# EAGLE design xe-sas (EAGLE 9.4.2)
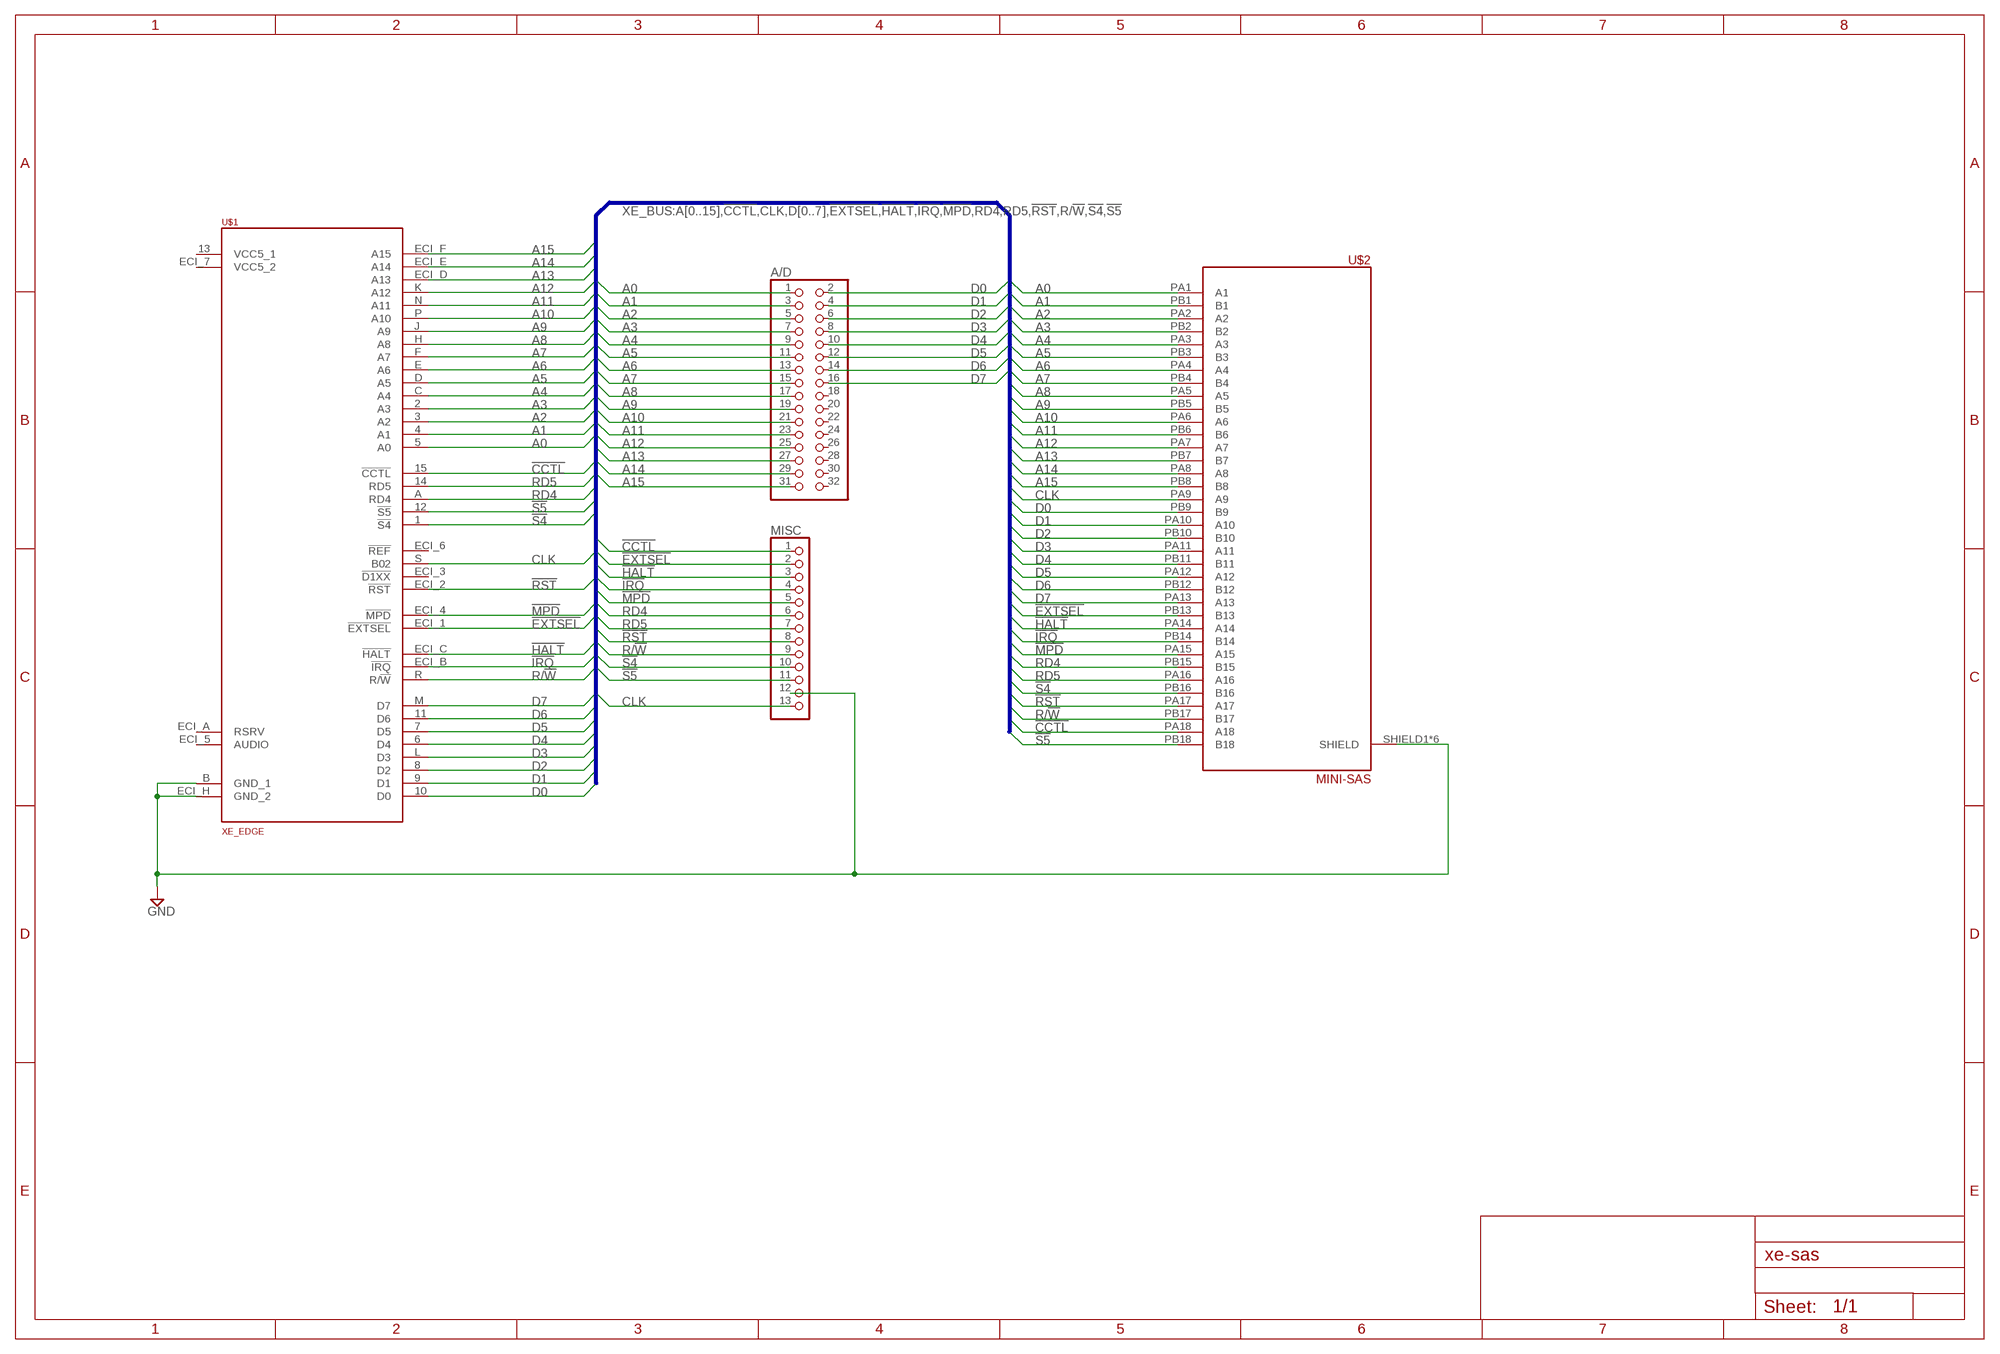
[diagram p0: schematic, sheet 1]

## Parts
A/D  PINHD-2X16  [2X16]
MISC  PINHD-1X13  [1X13]
U$1  XE_EDGE  [XE_EDGE]
U$2  MINI-SAS  [MINI-SAS]

## Nets
!CCTL!: MISC.1 U$1.15(!CCTL!) U$2.PA18(A18)
!EXTSEL!: MISC.2 U$1.ECI_1(!EXTSEL!) U$2.PB13(B13)
!HALT!: MISC.3 U$1.ECI_C(!HALT!) U$2.PA14(A14)
!IRQ!: MISC.4 U$1.ECI_B(!IRQ!) U$2.PB14(B14)
!MPD!: MISC.5 U$1.ECI_4(!MPD!) U$2.PA15(A15)
!RST!: MISC.8 U$1.ECI_2(!RST!) U$2.PA17(A17)
!S4!: MISC.10 U$1.1(!S4!) U$2.PB16(B16)
!S5!: MISC.11 U$1.12(!S5!) U$2.PB18(B18)
A0: A/D.1 U$1.5(A0) U$2.PA1(A1)
A1: A/D.3 U$1.4(A1) U$2.PB1(B1)
A2: A/D.5 U$1.3(A2) U$2.PA2(A2)
A3: A/D.7 U$1.2(A3) U$2.PB2(B2)
A4: A/D.9 U$1.C(A4) U$2.PA3(A3)
A5: A/D.11 U$1.D(A5) U$2.PB3(B3)
A6: A/D.13 U$1.E(A6) U$2.PA4(A4)
A7: A/D.15 U$1.F(A7) U$2.PB4(B4)
A8: A/D.17 U$1.H(A8) U$2.PA5(A5)
A9: A/D.19 U$1.J(A9) U$2.PB5(B5)
A10: A/D.21 U$1.P(A10) U$2.PA6(A6)
A11: A/D.23 U$1.N(A11) U$2.PB6(B6)
A12: A/D.25 U$1.K(A12) U$2.PA7(A7)
A13: A/D.27 U$1.ECI_D(A13) U$2.PB7(B7)
A14: A/D.29 U$1.ECI_E(A14) U$2.PA8(A8)
A15: A/D.31 U$1.ECI_F(A15) U$2.PB8(B8)
CLK: MISC.13 U$1.S(B02) U$2.PA9(A9)
D0: A/D.2 U$1.10(D0) U$2.PB9(B9)
D1: A/D.4 U$1.9(D1) U$2.PA10(A10)
D2: A/D.6 U$1.8(D2) U$2.PB10(B10)
D3: A/D.8 U$1.L(D3) U$2.PA11(A11)
D4: A/D.10 U$1.6(D4) U$2.PB11(B11)
D5: A/D.12 U$1.7(D5) U$2.PA12(A12)
D6: A/D.14 U$1.11(D6) U$2.PB12(B12)
D7: A/D.16 U$1.M(D7) U$2.PA13(A13)
GND: MISC.12 U$1.B(GND_1) U$1.ECI_H(GND_2) U$2.SHIELD1(SHIELD) U$2.SHIELD2(SHIELD) U$2.SHIELD3(SHIELD) U$2.SHIELD4(SHIELD) U$2.SHIELD5(SHIELD) U$2.SHIELD6(SHIELD)
R/!W!: MISC.9 U$1.R(R/!W!) U$2.PB17(B17)
RD4: MISC.6 U$1.A(RD4) U$2.PB15(B15)
RD5: MISC.7 U$1.14(RD5) U$2.PA16(A16)
Unconnected: A/D.18 A/D.20 A/D.22 A/D.24 A/D.26 A/D.28 A/D.30 A/D.32 U$1.13(VCC5_1) U$1.ECI_3(!D1XX!) U$1.ECI_5(AUDIO) U$1.ECI_6(!REF!) U$1.ECI_7(VCC5_2) U$1.ECI_A(RSRV)

## Buses
XE_BUS:A[0..15],!CCTL!,CLK,D[0..7],!EXTSEL!,!HALT!,!IRQ!,!MPD!,RD4,RD5,!RST!,R/!W!,!S4!,!S5!

## Library data of the parts
A/D = pinhead:PINHD-2X16: PIN HEADER
MISC = pinhead:PINHD-1X13: PIN HEADER
U$1 = pbxl:XE_EDGE: Atari XE Cartridge/ECI edge connector
U$2 = sjg-con:MINI-SAS: Mini-SAS connector, right angle through hole Part 1888019-4 Digikey part A111092CT-ND

## Net classes
1 Power: width 0.305 mm, drill 0.203 mm, clearance 0.203 mm

## Board
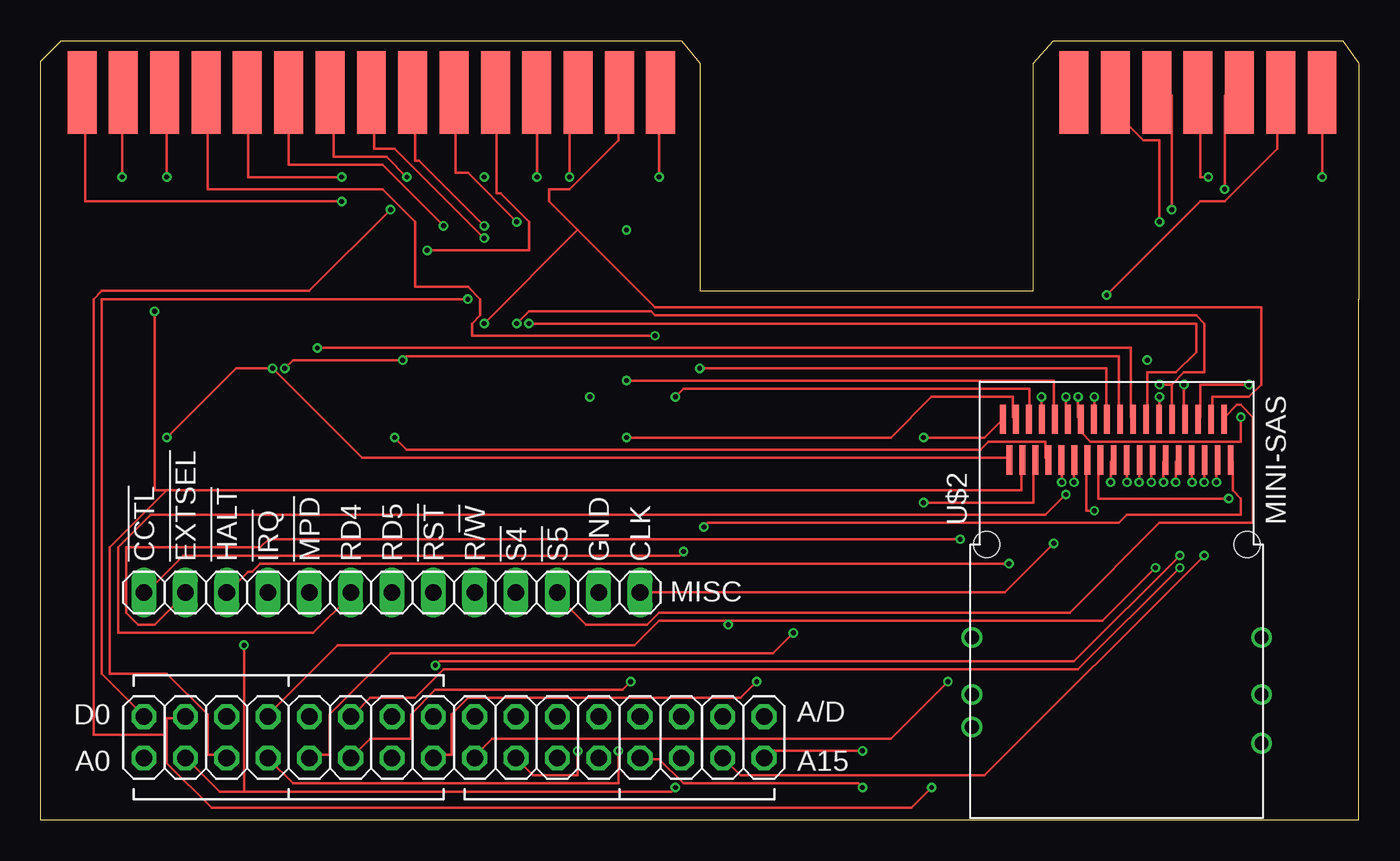
[diagram p1: board, top side]
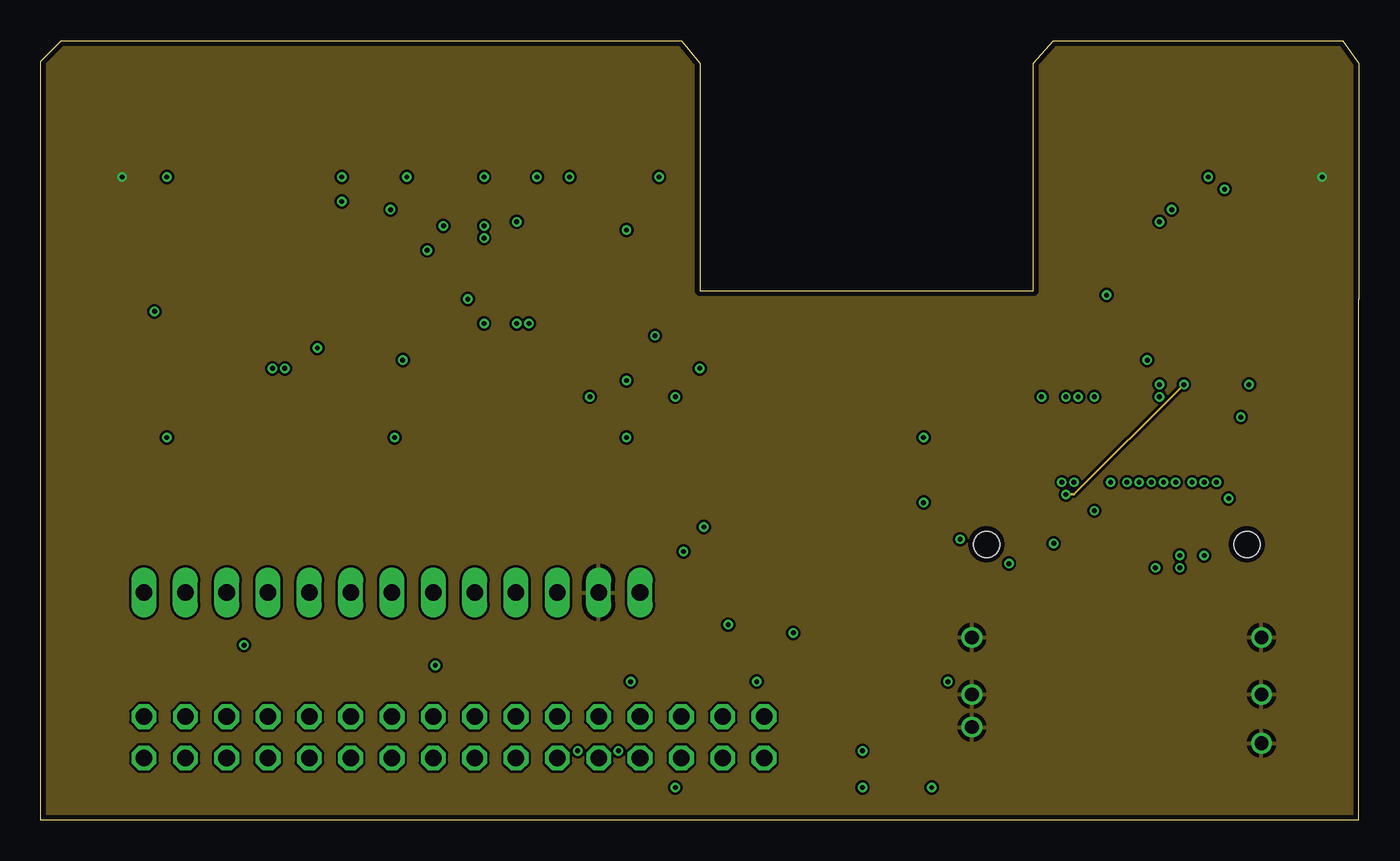
[diagram p2: board, inner layer Route2]
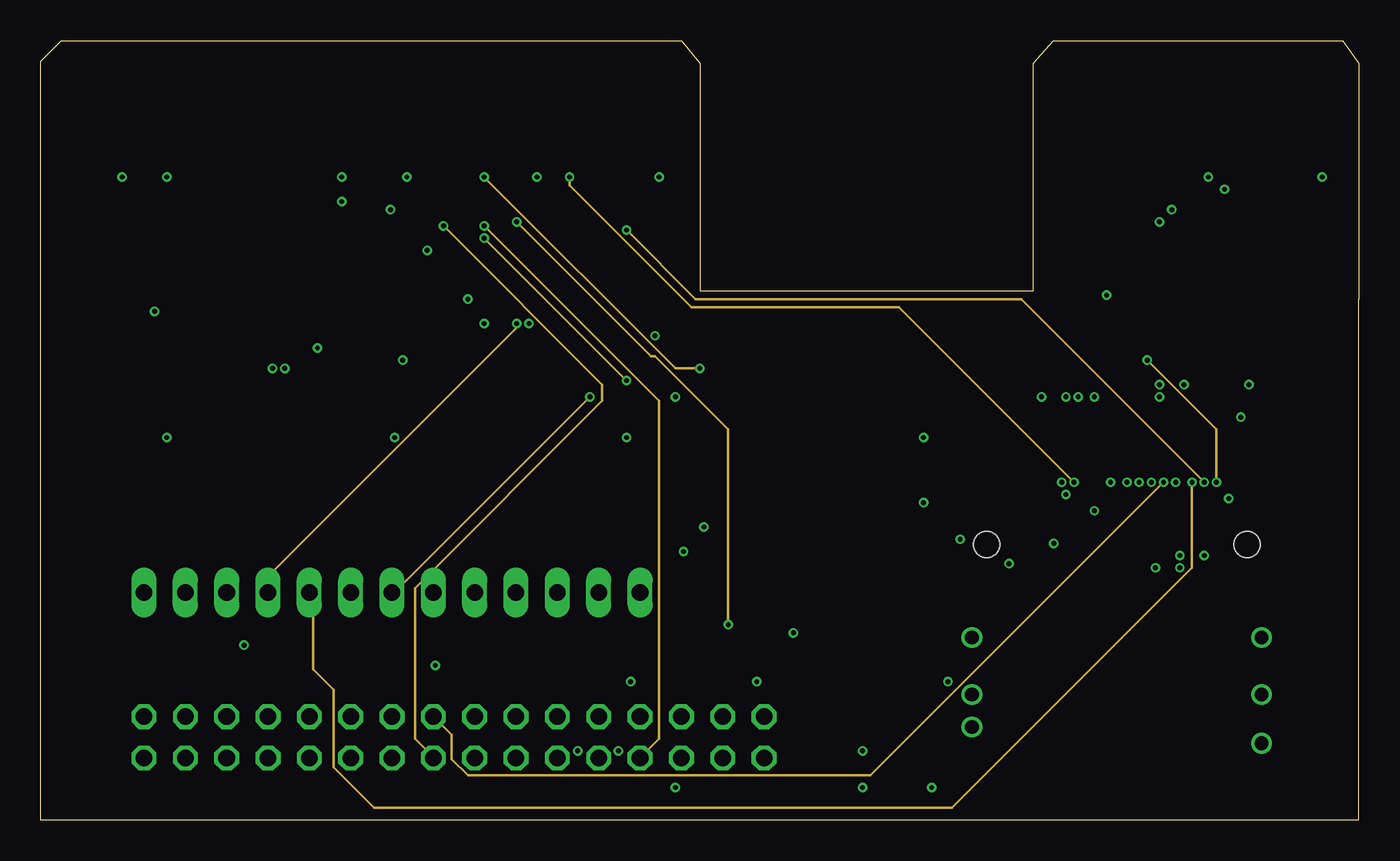
[diagram p3: board, inner layer Route15]
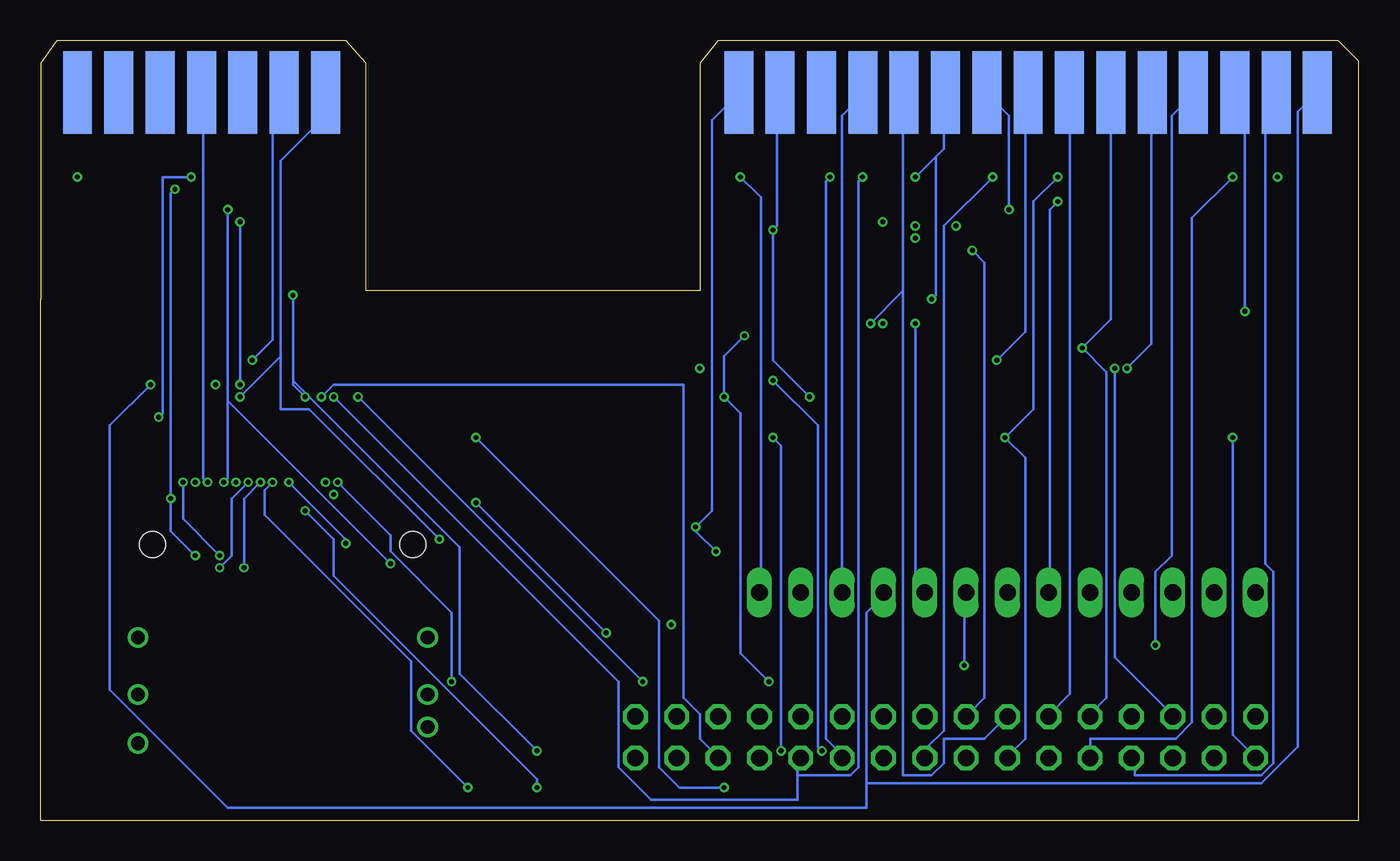
[diagram p4: board, bottom side, seen from below]

Size 81 x 47.88 mm. Coordinates in mm from the lower left corner, seen from the top.
Outline: 81,32 81,0 0,0 0,32
Copper layers (1+2*15+16): Top 0.035mm / dielectric 0.2mm / Route2 0.017mm / dielectric 1.2mm / Route15 0.017mm / dielectric 0.2mm / Bottom 0.035mm
Design rules "seed-4layer-6.6": minimum track width 6mil, minimum drill 0.3mm, track to track 6mil, track to pad 6mil, pad to pad 6mil, via to via 6mil, smd to smd 0mil, copper to edge 12mil, drill to drill 12mil, minimum pad ring 6mil, minimum via ring 5.5mil, stop-mask expansion 4mil, vias tented up to drill 25mil, thermal gap 10mil
vRestrict: area 5,15 to 39,23; area 1,2 to 5,9; area 46,2 to 50,8; area 0,40 to 82,48; area 57,0 to 75,15

### Footprints (pad centres in the part's own frame; a part is rotated, then mirrored left to right if it is on the bottom)
2X16 = drill 1.016 octagon: 1 -19.05,-1.27; 2 -19.05,1.27; 3 -16.51,-1.27; 4 -16.51,1.27; 5 -13.97,-1.27; 6 -13.97,1.27; 7 -11.43,-1.27; 8 -11.43,1.27; 9 -8.89,-1.27; 10 -8.89,1.27; 11 -6.35,-1.27; 12 -6.35,1.27; 13 -3.81,-1.27; 14 -3.81,1.27; 15 -1.27,-1.27; 16 -1.27,1.27; 17 1.27,-1.27; 18 1.27,1.27; 19 3.81,-1.27; 20 3.81,1.27; 21 6.35,-1.27; 22 6.35,1.27; 23 8.89,-1.27; 24 8.89,1.27; 25 11.43,-1.27; 26 11.43,1.27; 27 13.97,-1.27; 28 13.97,1.27; 29 16.51,-1.27; 30 16.51,1.27; 31 19.05,-1.27; 32 19.05,1.27
1X13 = drill 1.016 long: 1 -15.24,0; 2 -12.7,0; 3 -10.16,0; 4 -7.62,0; 5 -5.08,0; 6 -2.54,0; 7 0,0; 8 2.54,0; 9 5.08,0; 10 7.62,0; 11 10.16,0; 12 12.7,0; 13 15.24,0
XE_EDGE = smd 1.778 x 5.08 bottom: 1 2.54,12.7; 2 5.08,12.7; 3 7.62,12.7; 4 10.16,12.7; 5 12.7,12.7; 6 15.24,12.7; 7 17.78,12.7; 8 20.32,12.7; 9 22.86,12.7; 10 25.4,12.7; 11 27.94,12.7; 12 30.48,12.7; 13 33.02,12.7; 14 35.56,12.7; 15 38.1,12.7; ECI_1 63.5,12.7; ECI_2 66.04,12.7; ECI_3 68.58,12.7; ECI_4 71.12,12.7; ECI_5 73.66,12.7; ECI_6 76.2,12.7; ECI_7 78.74,12.7 | smd 1.778 x 5.08: A 2.54,12.7; B 5.08,12.7; C 7.62,12.7; D 10.16,12.7; E 12.7,12.7; ECI_A 63.5,12.7; ECI_B 66.04,12.7; ECI_C 68.58,12.7; ECI_D 71.12,12.7; ECI_E 73.66,12.7; ECI_F 76.2,12.7; ECI_H 78.74,12.7; F 15.24,12.7; H 17.78,12.7; J 20.32,12.7; K 22.86,12.7; L 25.4,12.7; M 27.94,12.7; N 30.48,12.7; P 33.02,12.7; R 35.56,12.7; S 38.1,12.7
MINI-SAS = smd 0.35 x 1.8: PA1 -6.2,8.78; PA2 -5.4,8.78; PA3 -4.6,8.78; PA4 -3.8,8.78; PA5 -3,8.78; PA6 -2.2,8.78; PA7 -1.4,8.78; PA8 -0.6,8.78; PA9 0.2,8.78; PA10 1,8.78; PA11 1.8,8.78; PA12 2.6,8.78; PA13 3.4,8.78; PA14 4.2,8.78; PA15 5,8.78; PA16 5.8,8.78; PA17 6.6,8.78; PA18 7.4,8.78; PB1 -6.6,11.29; PB2 -5.8,11.29; PB3 -5,11.29; PB4 -4.2,11.29; PB5 -3.4,11.29; PB6 -2.6,11.29; PB7 -1.8,11.29; PB8 -1,11.29; PB9 -0.2,11.29; PB10 0.6,11.29; PB11 1.4,11.29; PB12 2.2,11.29; PB13 3,11.29; PB14 3.8,11.29; PB15 4.6,11.29; PB16 5.4,11.29; PB17 6.2,11.29; PB18 7,11.29 | drill 0.85: SHIELD1 -8.5,-2.12; SHIELD2 -8.5,-5.62; SHIELD3 -8.5,-7.62; SHIELD4 9.3,-2.12; SHIELD5 9.3,-5.62; SHIELD6 9.3,-8.62 | hole 1.6: -7.6,3.6; 8.4,3.6

### Placement (x,y rotation side)
A/D  25.4,5.08 0 top
MISC  21.59,13.97 0 top
U$1  0,32 0 top
U$2  65.72,13.34 0 top

### Tracks (layer width: path | path; a pad name or v marks a point on that pad's centre or on a via)
!CCTL!  (via drill 0.3)
  Top 0.152: v40.75,18 41,18.25 66.25,18.25 66.75,18.75 73.75,18.75 73.75,19.75 73.25,20.25 73.25,22 U$2.PA18 | v39.5,16.5 39.25,16.25 8.75,16.25 6.5,14 MISC.1
  Bottom 0.152: U$1.15 38.25,44.5 39.75,43 39.75,19 v40.75,18 40.75,17.75 v39.5,16.5
!EXTSEL!  (via drill 0.3)
  Top 0.152: v68.75,26 68.75,24.75 U$2.PB13 | v56.5,17.25 14,17.25 13.5,16.75 5.25,16.75 5.25,12.75 6,12 7,12 8.75,13.75 MISC.2
  Bottom 0.152: 66.25,28.5 v68.75,26 | 66.25,28.5 66.25,40.5 63.5,43.25 U$1.ECI_1 | v56.5,17.25 64.5,25.25 66.25,25.25 66.25,28.5
!HALT!  (via drill 0.3)
  Top 0.152: v69.75,20.75 69.75,22 U$2.PA14 | v69.5,37.5 69.5,44.5 68.75,44.5 U$1.ECI_C | v59.5,15.75 13.5,15.75 13,15.25 12.75,15.25 11.5,14 MISC.3
  Bottom 0.152: v69.75,20.75 69.5,21 69.5,25.75 | v69.5,37.5 69.5,25.75 | 69.5,25.75 v59.5,15.75
!IRQ!  (via drill 0.3)
  Top 0.152: 69.5,26.75 69.5,24.75 U$2.PB14 | v68.75,26.75 69.5,26.75 | v68.75,36.75 68.75,41.75 67.75,41.75 66.25,43.25 66.25,44.5 U$1.ECI_B | v29.25,30.5 30,31.25 37.5,31.25 37.75,31 71,31 71.5,30.5 71.5,27.5 70.25,27.5 69.5,26.75
  Route15 0.152: v29.25,30.5 29.25,30.25 14,15 14,14 MISC.4
  Bottom 0.152: v68.75,36.75 v68.75,26.75
!MPD!  (via drill 0.3)
  Top 0.152: v70.75,20.75 70.75,22 U$2.PA15
  Route15 0.152: v70.75,20.75 70.75,15.5 56,0.75 20.5,0.75 18,3.25 18,8 16.75,9.25 16.75,13.75 MISC.5
  Bottom 0.152: v70.75,20.75 71,21 71,44.5 U$1.ECI_4
!RST!  (via drill 0.3)
  Top 0.152: v72.25,20.75 72.25,22 U$2.PA17 | v24.25,9.5 24.5,9.75 63.5,9.75 v70,16.25
  Route15 0.152: v72.25,20.75 72.25,24 v68,28.25
  Bottom 0.152: v68,28.25 66.75,29.5 66.75,44 66.25,44.5 U$1.ECI_2 | v24.25,9.5 24.25,13.75 MISC.8 | v70,16.25 72.25,18.5 v72.25,20.75
!S4!  (via drill 0.3)
  Top 0.152: v74.25,26.75 71.25,26.75 71.25,24.75 U$2.PB16
  Bottom 0.152: v74.25,26.75 76.75,24.25 76.75,8 69.5,0.75 30.25,0.75 30.25,2.25 | 30.25,2.25 30.25,12.75 29.25,13.75 MISC.10 | 30.25,2.25 6,2.25 3.75,4.5 3.75,43.5 2.75,44.5 U$1.1
!S5!
  Top 0.152: U$2.PB18 72.75,24.75 73.5,25.5 73.75,25.5 74.5,24.75 74.5,18.25 68.75,18.25 63.25,12.75 38,12.75 37.25,12 33.5,12 31.75,13.75 MISC.11
  Bottom 0.152: MISC.11 31.75,43.25 30.5,44.5 U$1.12
A0  (via drill 0.3)
  Top 0.152: U$2.PA1 59.5,22.25 19.75,22.25 v14.25,27.75 12,27.75 v7.75,23.5
  Bottom 0.152: v14.25,27.75 12.75,29.25 12.75,44.5 U$1.5 | v7.75,23.5 7.75,5.25 6.5,4 A/D.1
A1  (via drill 0.3)
  Top 0.152: v54.25,23.5 58,23.5 59,24.5 U$2.PB1 | v39,2 38.75,1.75 12.5,1.75 | 12.5,1.75 11,1.75 9,3.75 A/D.3 | 12.5,1.75 v12.5,10.75
  Bottom 0.152: v54.25,23.5 43,12.25 43,3.25 41.75,2 v39,2 | v12.5,10.75 12.5,15.25 11.5,16.25 11.5,43.25 10.25,44.5 U$1.4
A2  (via drill 0.3)
  Top 0.152: 7.75,20.25 60.25,20.25 60.25,22 U$2.PA2 | 7.75,20.25 4.25,16.75 4.25,9 7.75,9 10.25,6.5 10.25,4 11.25,4 A/D.5 | v7,31.25 7,20.25 7.75,20.25
  Bottom 0.152: v7,31.25 7,44 7.5,44.5 U$1.3
A3  (via drill 0.3)
  Top 0.152: v36,23.5 52.25,23.5 54.75,26 59.75,26 59.75,24.75 U$2.PB2 | v35.5,4.25 35.5,2.25 15.5,2.25 14,3.75 A/D.7
  Bottom 0.152: v36,23.5 35.5,23 v35.5,4.25 | U$1.2 5.25,44.5 5.75,44 5.75,15.75 5.25,15.25 5.25,3.5 6,2.75 13.75,2.75 13.75,3.75 A/D.7
A4  (via drill 0.3)
  Top 0.152: v54.25,19.5 61,19.5 61,22 U$2.PA3 | v46.25,11.5 45,10.25 21.5,10.25 17.75,6.5 17.75,4 16.75,4 A/D.9 | v7.75,39.5 7.75,44.5 U$1.C
  Bottom 0.152: v46.25,11.5 v54.25,19.5 | v7.75,39.5 10.25,37 10.25,6 11.25,5 16.5,5 16.5,4 A/D.9
A5  (via drill 0.3)
  Top 0.152: v39,26 39.5,26.5 60.75,26.5 60.75,24.75 U$2.PB3 | v36.25,8.5 35.75,8 24.25,8 22.75,6.5 22.75,5 20.25,5 19.25,4 A/D.11 | v37.75,29.75 26.5,29.75 26.5,30.5 27,31 27,32 26.25,32.75 23,32.75 23,36.75 21,38.75 10.25,38.75 10.25,44.5 U$1.D
  Bottom 0.152: v36.25,8.5 38,10.25 38,25 v39,26 39,28.5 v37.75,29.75
A6  (via drill 0.3)
  Top 0.152: v21.75,23.5 22.5,22.75 57.75,22.75 58.25,23.25 61.75,23.25 61.75,22.25 U$2.PA4 | v18.5,39.5 12.75,39.5 12.75,44.5 U$1.E
  Bottom 0.152: A/D.13 21.5,4 20.5,5 20.5,22.25 v21.75,23.5 20,25.25 20,38 v18.5,39.5
A7  (via drill 0.3)
  Top 0.152: v61.5,26 61.5,24.75 U$2.PB4 | v44,8.5 43,7.5 26.25,7.5 25.25,6.5 25.25,4 24.25,4 A/D.15 | v24.75,36.5 21,40.25 15.25,40.25 15.25,44.5 U$1.F
  Route15 0.152: v24.75,36.5 34.5,26.75 34.5,25.75 23,14.25 23,5 24,4 A/D.15
  Bottom 0.152: v44,8.5 v61.5,26
A8  (via drill 0.3)
  Top 0.152: v62.75,20.75 62.75,22 U$2.PA5 | v55.75,8.5 52.25,5 27.75,5 26.75,4 A/D.17 | v22.5,39.5 21.25,40.75 18,40.75 18,44.5 U$1.H
  Bottom 0.152: v62.75,20.75 59.5,17.5 59.5,16.5 55.75,12.75 v55.75,8.5 | v22.5,39.5 25.5,36.5 25.5,5.5 26.5,4.5 26.5,4 A/D.17
A9  (via drill 0.3)
  Top 0.152: v36,27 62.25,27 62.25,24.75 U$2.PB5 | v33,4.25 33,2.75 30.25,2.75 29.25,3.75 A/D.19 | v27.25,35.75 21.75,41.25 20.5,41.25 20.5,44.5 U$1.J
  Route15 0.152: v36,27 v27.25,35.75
  Bottom 0.152: v36,27 33.25,24.25 33.25,4.5 v33,4.25
A10  (via drill 0.3)
  Top 0.152: v63.5,20.75 63.5,22 U$2.PA6 | v32.5,39.5 32.5,44.5 33,44.5 U$1.P
  Route15 0.152: v63.5,20.75 52.75,31.5 40,31.5 32.5,39 v32.5,39.5
  Bottom 0.152: v32.5,39.5 32.75,39.25 32.75,5 31.75,4 A/D.21
A11  (via drill 0.3)
  Top 0.152: v63,26 63,24.75 U$2.PB6 | v30.5,39.5 30.5,44.5 U$1.N
  Bottom 0.152: v63,26 45.5,8.5 45.5,3.25 43.5,1.25 34.5,1.25 34.5,2.75 | 34.5,2.75 34.5,3.75 A/D.23 | v30.5,39.5 30.75,39.25 30.75,3.25 31.25,2.75 34.5,2.75
A12  (via drill 0.3)
  Top 0.152: v64.75,19 64.25,19 64.25,22 U$2.PA7 | v50.5,2 50.25,2.25 39.5,2.25 38,3.75 37,3.75 A/D.25 | v27.25,36.5 23.25,40.5 23,40.5 23,44.5 U$1.K
  Route15 0.152: v27.25,36.5 38,25.75 38,5 37,4 A/D.25
  Bottom 0.152: v64.75,19 63,17.25 63,15 50.5,2.5 v50.5,2
A13  (via drill 0.3)
  Top 0.152: v63.75,26 63.75,24.75 U$2.PB7 64,24.5 64,23.75 64.5,23.25 73.75,23.25 v73.75,24.75 | v71.75,39.5 71.25,39.5 71.25,44.5 U$1.ECI_D
  Bottom 0.152: v63.75,26 63,26.75 41.5,26.75 41.5,7.5 40.5,6.5 40.5,5 39.5,4 A/D.27 | v71.75,39.5 73.5,39.5 73.5,25 v73.75,24.75
A14  (via drill 0.3)
  Top 0.152: v73,19.75 65,19.75 65,22 U$2.PA8 | v72.75,38.75 72.75,44.5 73.5,44.5 U$1.ECI_E | v71.5,16.25 58,2.75 43,2.75 42,3.75 A/D.29
  Bottom 0.152: v72.75,38.75 73,38.5 v73,19.75 73,17.75 v71.5,16.25
A15  (via drill 0.3)
  Top 0.152: v64.75,26 64.75,24.75 U$2.PB8 | v65.5,32.25 71.25,38 72.75,38 76,41.25 76,44.5 U$1.ECI_F | v50.5,4.25 44.75,4.25 44.5,4 A/D.31
  Bottom 0.152: v64.75,26 65.5,26.75 65.5,27 | v65.5,32.25 65.5,27 | v50.5,4.25 55.25,9 55.25,16.75 65.5,27
CLK  (via drill 0.3)
  Top 0.152: v65.75,20.75 65.75,22 U$2.PA9 | v62.25,17 59.25,14 37,14 MISC.13 | v38,39.5 38,44.5 U$1.S
  Bottom 0.152: v65.75,20.75 62.25,17.25 v62.25,17 | v38,39.5 36.75,38.25 36.75,14 MISC.13
D0  (via drill 0.3)
  Top 0.152: v40.5,27.75 65.5,27.75 65.5,24.75 U$2.PB9 | v26.25,32 3.75,32 3.75,9 6.25,6.5 A/D.2
  Route15 0.152: v40.5,27.75 39,27.75 v27.25,39.5
  Bottom 0.152: 26,40.75 25.5,41.25 25.5,44.5 U$1.10 | 26,40.75 v27.25,39.5 | v26.25,32 26,32.25 26,40.75
D1  (via drill 0.3)
  Top 0.152: v66.75,20.75 66.75,22 U$2.PA10 | v54.75,2 53.5,0.75 10.5,0.75 7.75,3.5 7.75,5.25 | 7.75,5.25 7.75,6.25 8.75,6.25 A/D.4 | v21.5,37.5 16.5,32.5 3.75,32.5 3.25,32 3.25,5.25 7.75,5.25
  Bottom 0.152: v66.75,20.75 67.25,20.25 67.25,18.75 58.25,9.75 58.25,5.5 v54.75,2 | v21.5,37.5 21.5,43.25 22.75,44.5 U$1.9
D2  (via drill 0.3)
  Top 0.152: U$2.PB10 66.25,24.75 66.25,28.5 22.5,28.5 v22.25,28.25 15.5,28.25 v15,27.75
  Bottom 0.152: v22.25,28.25 20.5,30 20.5,44.5 U$1.8 | v15,27.75 15,10 11.5,6.5 A/D.6
D3  (via drill 0.3)
  Top 0.152: v67.5,20.75 67.5,22 U$2.PA11 | v68.5,15.5 65.25,12.25 42.25,12.25 | 42.25,12.25 38,12.25 36.5,10.75 18.25,10.75 14,6.5 A/D.8 | v29.25,36.75 26.25,39.75 25.5,39.75 25.5,44.5 U$1.L | 42.25,12.25 v42.25,12
  Route15 0.152: v29.25,36.75 37.5,28.5 37.75,28.5 42.25,24 v42.25,12
  Bottom 0.152: v67.5,20.75 68.5,19.75 v68.5,15.5
D4  (via drill 0.3)
  Top 0.152: v17,29 67,29 67,24.75 U$2.PB11
  Bottom 0.152: U$1.6 15.25,44.5 15.25,30.75 v17,29 15.5,27.5 15.5,7.5 16.5,6.5 A/D.10
D5  (via drill 0.3)
  Top 0.152: v68.25,20.75 68.25,22 U$2.PA12 | v70,15.5 63.75,9.25 24.75,9.25 23,7.5 20.25,7.5 19.25,6.5 A/D.12
  Bottom 0.152: v68.25,20.75 69.25,19.75 69.25,16.25 v70,15.5 | U$1.7 17.75,44.5 17.75,7.75 19,6.5 A/D.12
D6  (via drill 0.3)
  Top 0.152: v30,30.5 71,30.5 71,28.75 69.75,27.5 68,27.5 68,24.75 U$2.PB12
  Bottom 0.152: 28,32.5 v30,30.5 | 28,32.5 28,44.5 U$1.11 | 28,32.5 28,2.75 26.25,2.75 25.5,3.5 25.5,5 23,5 21.75,6.25 A/D.14
D7  (via drill 0.3)
  Top 0.152: v69,20.75 69,22 U$2.PA13 | v23.75,35 30,35 30,36.75 28.25,38.5 28,38.5 28,44.5 U$1.M
  Route15 0.152: v69,20.75 51,2.75 26.25,2.75 25.25,3.75 25.25,5.25 24.25,6.25 A/D.16
  Bottom 0.152: v23.75,35 23,34.25 23,7.5 24,6.5 A/D.16
GND  (via drill 0.3)
  Top 0.152: v5,39.5 5,44.5 U$1.B | v78.75,39.5 78.75,44.5 U$1.ECI_H
  pour Route2: -1,50 82,50 82,-1 -1,-1
R/!W!  (via drill 0.3)
  Top 0.152: 33,36.25 31.25,38 31.25,38.75 32.5,38.75 35.5,41.75 35.5,44.5 U$1.R | 33,36.25 37.75,31.5 75,31.5 75,26.75 74.25,26 72,26 72,24.75 U$2.PB17 | 33,36.25 v27.25,30.5
  Bottom 0.152: v27.25,30.5 27.25,14.5 26.75,14 MISC.9
RD4  (via drill 0.3)
  Top 0.152: v70.25,26.75 70.25,24.75 U$2.PB15 | v63,20 61.75,18.75 6.75,18.75 4.75,16.75 4.75,11.5 16.75,11.5 19,13.75 MISC.6 | v18.5,38 2.75,38 2.75,44.5 U$1.A
  Route2 0.152: v70.25,26.75 63.5,20 v63,20
  Bottom 0.152: v18.5,38 19,37.5 19,14 MISC.6
RD5  (via drill 0.3)
  Top 0.152: v71.5,20.75 71.5,22 U$2.PA16
  Route15 0.152: v71.5,20.75 60.25,32 40.25,32 v36,36.25 | v33.75,26 21.75,14 MISC.7
  Bottom 0.152: U$1.14 35.75,44.5 35.75,36.5 v36,36.25 36,28.25 v33.75,26

### Text on the board
tPlace: !CCTL! | !EXTSEL! | !HALT! | !IRQ! | !MPD! | RD4 | RD5 | !RST! | R/!W! | !S4! | !S5! | GND | CLK | D0 | A0 | A15